# Altium schematic sheet ESP32-S3-MINI-1-N4R2.schdoc
size 124 x 101 mm
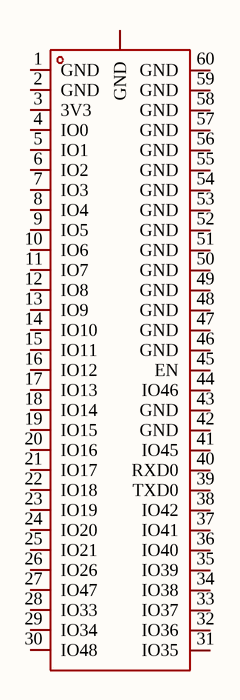
[diagram p0: ESP32-S3-MINI-1-N4R2.schdoc]

## Parts
U?  ESP32-S3-MINI-1-N4R2  [BULETM-SMD_ESP32-S3-MINI-1-N8]  (value not drawn)

## Nets

Not connected (* = marked no-connect by the designer): U? 1(GND) 2(GND) 3(3V3) 4(IO0) 5(IO1) 6(IO2) 7(IO3) 8(IO4) 9(IO5) 10(IO6) 11(IO7) 12(IO8) 13(IO9) 14(IO10) 15(IO11) 16(IO12) 17(IO13) 18(IO14) 19(IO15) 20(IO16) 21(IO17) 22(IO18) 23(IO19) 24(IO20) 25(IO21) 26(IO26) 27(IO47) 28(IO33) 29(IO34) 30(IO48) 31(IO35) 32(IO36) 33(IO37) 34(IO38) 35(IO39) 36(IO40) 37(IO41) 38(IO42) 39(TXD0) 40(RXD0) 41(IO45) 42(GND) 43(GND) 44(IO46) 45(EN) 46(GND) 47(GND) 48(GND) 49(GND) 50(GND) 51(GND) 52(GND) 53(GND) 54(GND) 55(GND) 56(GND) 57(GND) 58(GND) 59(GND) 60(GND) GND

## Library data of the parts
U? = ESP32-S3-MINI-1-N4R2: Manufacturer: ESPRESSIF(乐鑫); Add into BOM: yes; Antenna Type: 板载PCBAntenna; Symbol: ESP32-S3-MINI-1-N4R2; Device: ESP32-S3-MINI-1-N4R2; LCSC Part Name: ESP32-S3-MINI-1-N4R2; Supplier Part: C3013941; Manufacturer Part: ESP32-S3-MINI-1-N4R2; Supplier Footprint: SMD; JLCPCB Part Class: Extended Part; Supplier: LCSC; Convert to PCB: yes